# EasyEDA Pro project 基于LVGL与Free RTOS的智能终端.eprj

# Schematic Schematic1
Board Name: Board1; Create Date: 2025-12-01; Page Name: P1; Project Name: 基于LVGL与Free RTOS的智能终端; Schematic Name: Schematic1; Update Date: 2025-12-01; Company: 嘉立创EDA; Page Size: A4; Version: V1.0
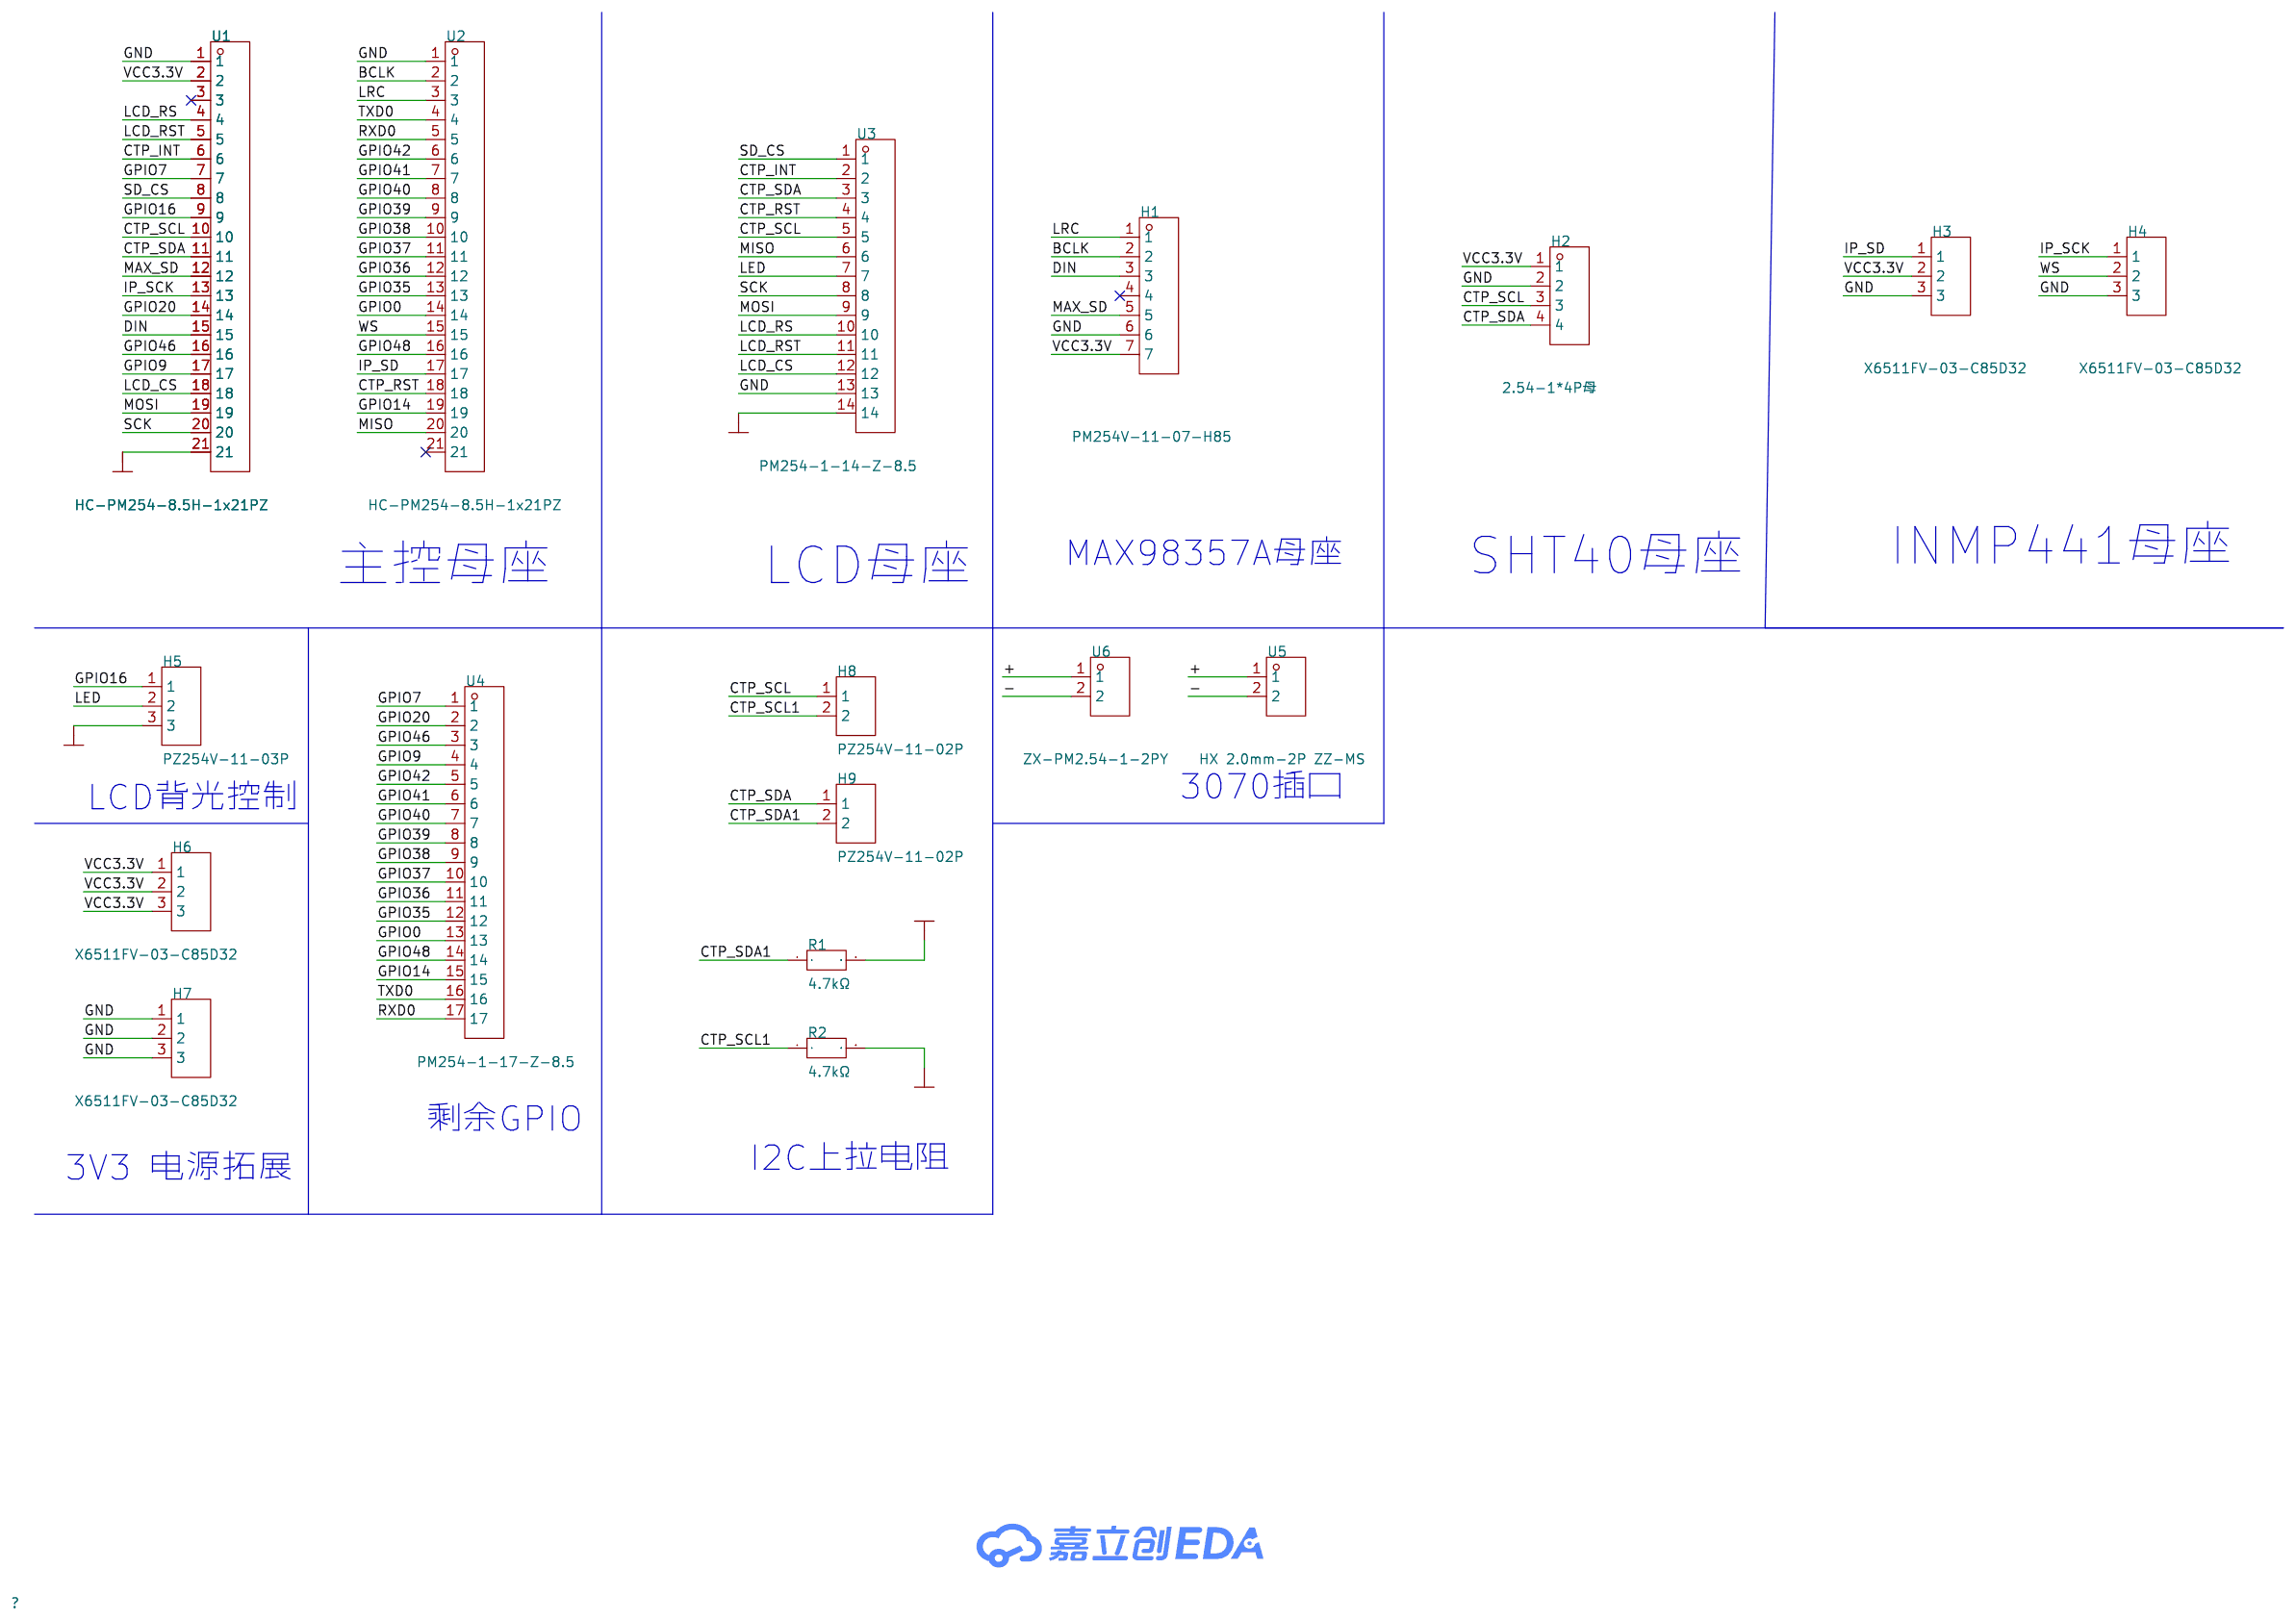
[diagram p0: schematic sheet]

## Parts
H1  PM254V-11-07-H85  [HDR-TH_7P-P2.54-V-F]
H2  2.54-1*4P母  [HDR-TH_4P-P2.54-V-F]
H3  X6511FV-03-C85D32  [HDR-TH_3P-P2.54-V-F]
H4  X6511FV-03-C85D32  [HDR-TH_3P-P2.54-V-F]
H5  PZ254V-11-03P  [HDR-TH_3P-P2.54-V-M]
H6  X6511FV-03-C85D32  [HDR-TH_3P-P2.54-V-F]
H7  X6511FV-03-C85D32  [HDR-TH_3P-P2.54-V-F]
H8  PZ254V-11-02P  [HDR-TH_2P-P2.54-V-M]
H9  PZ254V-11-02P  [HDR-TH_2P-P2.54-V-M]
R1  4.7kΩ  [R0603]
R2  4.7kΩ  [R0603]
U1  HC-PM254-8.5H-1x21PZ  [HDR-TH_21P-P2.54-V-F_1]
U2  HC-PM254-8.5H-1x21PZ  [HDR-TH_21P-P2.54-V-F_1]
U3  PM254-1-14-Z-8.5  [HDR-TH_14P-P2.54-V-F-1]
U4  PM254-1-17-Z-8.5  [HDR-TH_17P-P2.54-V-F]
U5  HX 2.0mm-2P ZZ-MS  [CONN-TH_2P-P2.00_HX-2.0MM-2P-ZZ]
U6  ZX-PM2.54-1-2PY  [HDR-TH_2P-P2.54-V-F]

## Library data of the parts
H1 = PM254V-11-07-H85: LCSC Part Name: 间距:2.54mm 1x7P 直插; Supplier Part: C2832270; Manufacturer: XFCN(兴飞); Supplier Footprint: 插件,P=2.54mm; JLCPCB Part Class: 扩展库; Datasheet: https://item.szlcsc.com/datasheet/PM254V-11-07-H85/2989788.html; Supplier: LCSC; Holes Structure: 1x7P; Pitch: 2.54mm; Circular Hole / Square Hole: 方孔; Mounting Type: 直插; Number of Rows: 单排; Number of Positions: 7P; Current Rating: 3A; Voltage Rating (Max): 250V; Holes Direction: 顶部; Operating Temperature: -40℃~+105℃
H2 = 2.54-1*4P母: LCSC Part Name: 间距:2.54mm 1x4P 直插; Supplier Part: C2718488; Manufacturer: BOOMELE(博穆精密); Supplier Footprint: 插件,P=2.54mm; JLCPCB Part Class: 扩展库; Datasheet: https://item.szlcsc.com/datasheet/2.54-1*4P%25E6%25AF%258D/2834502.html; Supplier: LCSC; Holes Structure: 1x4P; Pitch: 2.54mm; Circular Hole / Square Hole: 方孔; Mounting Type: 直插; Number of Rows: 单排; Number of Positions: 4P; Current Rating: 3A; Holes Direction: 顶部; Contact Material: 青铜; Operating Temperature: -40℃~+105℃
H3 H4 H6 H7 = X6511FV-03-C85D32: LCSC Part Name: 间距:2.54mm 1x3P 直插; Supplier Part: C718242; Manufacturer: XKB Connection(中国星坤); Supplier Footprint: 插件,P=2.54mm; JLCPCB Part Class: 扩展库; Datasheet: https://item.szlcsc.com/datasheet/X6511FV-03-C85D32/760117.html; Supplier: LCSC; Holes Structure: 1x3P; Pitch: 2.54mm; Circular Hole / Square Hole: 方孔; Mounting Type: 直插; Number of Rows: 单排; Number of Positions: 3P; Current Rating: 3A; Voltage Rating (Max): 250V; Holes Direction: 顶部; Insulation Height: 8.5mm; Contact Material: 黄铜; Contact Plating: 金; Operating Temperature: -40℃~+105℃
H5 = PZ254V-11-03P: LCSC Part Name: 1x3P 间距:2.54mm 方针 直插; Supplier Part: C2937625; Manufacturer: XFCN(兴飞); Supplier Footprint: 插件,P=2.54mm; JLCPCB Part Class: 扩展库; Datasheet: https://item.szlcsc.com/datasheet/PZ254V-11-03P/3293280.html; Supplier: LCSC; Pin Structure: 1x3P; Pitch: 2.54mm; Circluar Pins/Square Pins: 方针; Mounting Type: 直插; Number of Rows: 单排; Number of Pins: 3P; Current Rating: 3A; Voltage Rating (Max): 250V; Length of Mating Pin: 6mm; Insulation Height: 2.5mm; Length of End Connection Pin: 3mm; Operating Temperature: -40℃~+105℃; Color: 黑色
H8 H9 = PZ254V-11-02P: LCSC Part Name: 1x2P 间距:2.54mm 方针 直插; Supplier Part: C492401; Manufacturer: XFCN(兴飞); Supplier Footprint: 插件,P=2.54mm; JLCPCB Part Class: 扩展库; Datasheet: https://item.szlcsc.com/datasheet/PZ254V-11-02P/502957.html; Supplier: LCSC; Pin Structure: 1x2P; Pitch: 2.54mm; Circluar Pins/Square Pins: 方针; Mounting Type: 直插; Number of Rows: 单排; Number of Pins: 2P; Length of Mating Pin: 6mm; Insulation Height: 2.5mm; Length of End Connection Pin: 3mm; Contact Material: 黄铜; Operating Temperature: -40℃~+105℃; Color: 黑色
R1 R2 = RCA034K7JLF: LCSC Part Name: 4.7kΩ ±5% 100mW; Supplier Part: C22356632; Manufacturer: HKR(香港电阻); Supplier Footprint: 0603; JLCPCB Part Class: 扩展库; Datasheet: https://item.szlcsc.com/datasheet/RCA034K7JLF/23790076.html; Supplier: LCSC; Type: 厚膜电阻; Tolerance: ±5%; Power(Watts): 100mW; Voltage-Supply(Max): 75V; Temperature Coefficient: ±100ppm/℃; Operating Temperature: -55℃~+155℃
U1 U2 = HC-PM254-8.5H-1x21PZ: LCSC Part Name: 间距2.54mm 1x21Pin 直插 PC3.0 H8.5; Supplier Part: C41376160; Manufacturer: HC(虹成电子); Supplier Footprint: 插件,P=2.54mm; JLCPCB Part Class: 扩展库; Datasheet: https://item.szlcsc.com/datasheet/HC-PM254-8.5H-1x21PZ/43143859.html; Supplier: LCSC; Holes Structure: 1x21P; Pitch: 2.54mm; Circular Hole / Square Hole: 方孔; Mounting Type: 直插; Number of Rows: 单排; Number of Positions: 21P; Current Rating: 3A; Holes Direction: 顶部; Insulation Height: 8.5mm; Contact Material: 黄铜; Contact Plating: 金; Operating Temperature: -40℃~+105℃; PIN Length: 3mm
U3 = PM254-1-14-Z-8.5: LCSC Part Name: 1x14P 间距:2.54mm 直插; Supplier Part: C2897377; Manufacturer: HCTL(华灿天禄); Supplier Footprint: 插件,P=2.54mm; JLCPCB Part Class: 扩展库; Datasheet: https://item.szlcsc.com/datasheet/PM254-1-14-Z-8.5/3142382.html; Supplier: LCSC; Holes Structure: 1x14P; Pitch: 2.54mm; Circular Hole / Square Hole: 方孔; Mounting Type: 直插; Number of Rows: 单排; Number of Positions: 14P; Current Rating: 3A; Holes Direction: 顶部; Insulation Height: 8.5mm; Contact Material: 铜合金; Operating Temperature: -40℃~+105℃
U4 = PM254-1-17-Z-8.5: LCSC Part Name: 1x17P 间距:2.54mm 直插; Supplier Part: C2897380; Manufacturer: HCTL(华灿天禄); Supplier Footprint: 插件,P=2.54mm; JLCPCB Part Class: 扩展库; Datasheet: https://item.szlcsc.com/datasheet/PM254-1-17-Z-8.5/3142385.html; Supplier: LCSC; Holes Structure: 1x17P; Pitch: 2.54mm; Circular Hole / Square Hole: 方孔; Mounting Type: 直插; Number of Rows: 单排; Number of Positions: 17P; Current Rating: 3A; Holes Direction: 顶部; Insulation Height: 8.5mm; Contact Material: 铜合金; Operating Temperature: -40℃~+105℃
U5 = HX 2.0mm-2P ZZ-MS: LCSC Part Name: 1x2P 间距:2mm 直插 系列:PH; Supplier Part: C7543406; Manufacturer: hanxia(韩下); Supplier Footprint: 插件,P=2mm; Datasheet: https://item.szlcsc.com/datasheet/HX%25202.0mm-2P%2520ZZ-MS/8648012.html; Supplier: LCSC; Pins Structure: 1x2P; Pitch: 2mm; Mounting Type: 直插; Reference Series: PH; Number of Pins: 2P; Number of Rows: 1; Number of PINs Per Row: 2; Current Rating: 2A; Contact Material: 黄铜; Contact Plating: 锡; Operating Temperature: -25℃~+85℃; Voltage Rating: 250V; Plastic Material: PA6T; Flame Retardant Rating: UL94V-0; Color: 米色
U6 = ZX-PM2.54-1-2PY: LCSC Part Name: 1x2P 间距:2.54mm 直插; Supplier Part: C7499322; Manufacturer: Megastar(兆星); Supplier Footprint: 插件,P=2.54mm; Datasheet: https://item.szlcsc.com/datasheet/ZX-PM2.54-1-2PY/8573983.html; Supplier: LCSC; Holes Structure: 1x2P; Pitch: 2.54mm; Circular Hole / Square Hole: 方孔; Mounting Type: 直插; Number of Rows: 单排; Number of Positions: 2P; Current Rating: 3A; Holes Direction: 顶部; Insulation Height: 8.5mm; Contact Material: 黄铜; Contact Plating: 金; Operating Temperature: -40℃~+105℃; PIN Length: 3.2mm

## Nets
3V3: H5.3 R1.2 R2.2 U1.21 U3.14
GND: H1.6 H2.2 H3.3 H4.3 H7.1 H7.2 H7.3 U1.1 U2.1 U3.13
VCC3.3V: H1.7 H2.1 H3.2 H6.1 H6.2 H6.3 U1.2
+: U5.1 U6.1
-: U5.2 U6.2
BCLK: H1.2 U2.2
CTP_INT: U1.6 U3.2
CTP_RST: U2.18 U3.4
CTP_SCL: H2.3 H8.1 U1.10 U3.5
CTP_SCL1: H8.2 R2.1
CTP_SDA: H2.4 H9.1 U1.11 U3.3
CTP_SDA1: H9.2 R1.1
DIN: H1.3 U1.15
GPIO0: U2.14 U4.13
GPIO7: U1.7 U4.1
GPIO9: U1.17 U4.4
GPIO14: U2.19 U4.15
GPIO16: H5.1 U1.9
GPIO20: U1.14 U4.2
GPIO35: U2.13 U4.12
GPIO36: U2.12 U4.11
GPIO37: U2.11 U4.10
GPIO38: U2.10 U4.9
GPIO39: U2.9 U4.8
GPIO40: U2.8 U4.7
GPIO41: U2.7 U4.6
GPIO42: U2.6 U4.5
GPIO46: U1.16 U4.3
GPIO48: U2.16 U4.14
IP_SCK: H4.1 U1.13
IP_SD: H3.1 U2.17
LCD_CS: U1.18 U3.12
LCD_RS: U1.4 U3.10
LCD_RST: U1.5 U3.11
LED: H5.2 U3.7
LRC: H1.1 U2.3
MAX_SD: H1.5 U1.12
MISO: U2.20 U3.6
MOSI: U1.19 U3.9
RXD0: U2.5 U4.17
SCK: U1.20 U3.8
SD_CS: U1.8 U3.1
TXD0: U2.4 U4.16
WS: H4.2 U2.15

Not connected (* = marked no-connect by the designer): H1 4*; U1 3*; U2 21*

## Notes on the sheet
- MAX98357A母座
- INMP441母座
- 主控母座
- LCD母座
- SHT40母座
- 3070插口
- LCD背光控制
- 剩余GPIO
- I2C上拉电阻
- 3V3 电源拓展

# Board PCB1
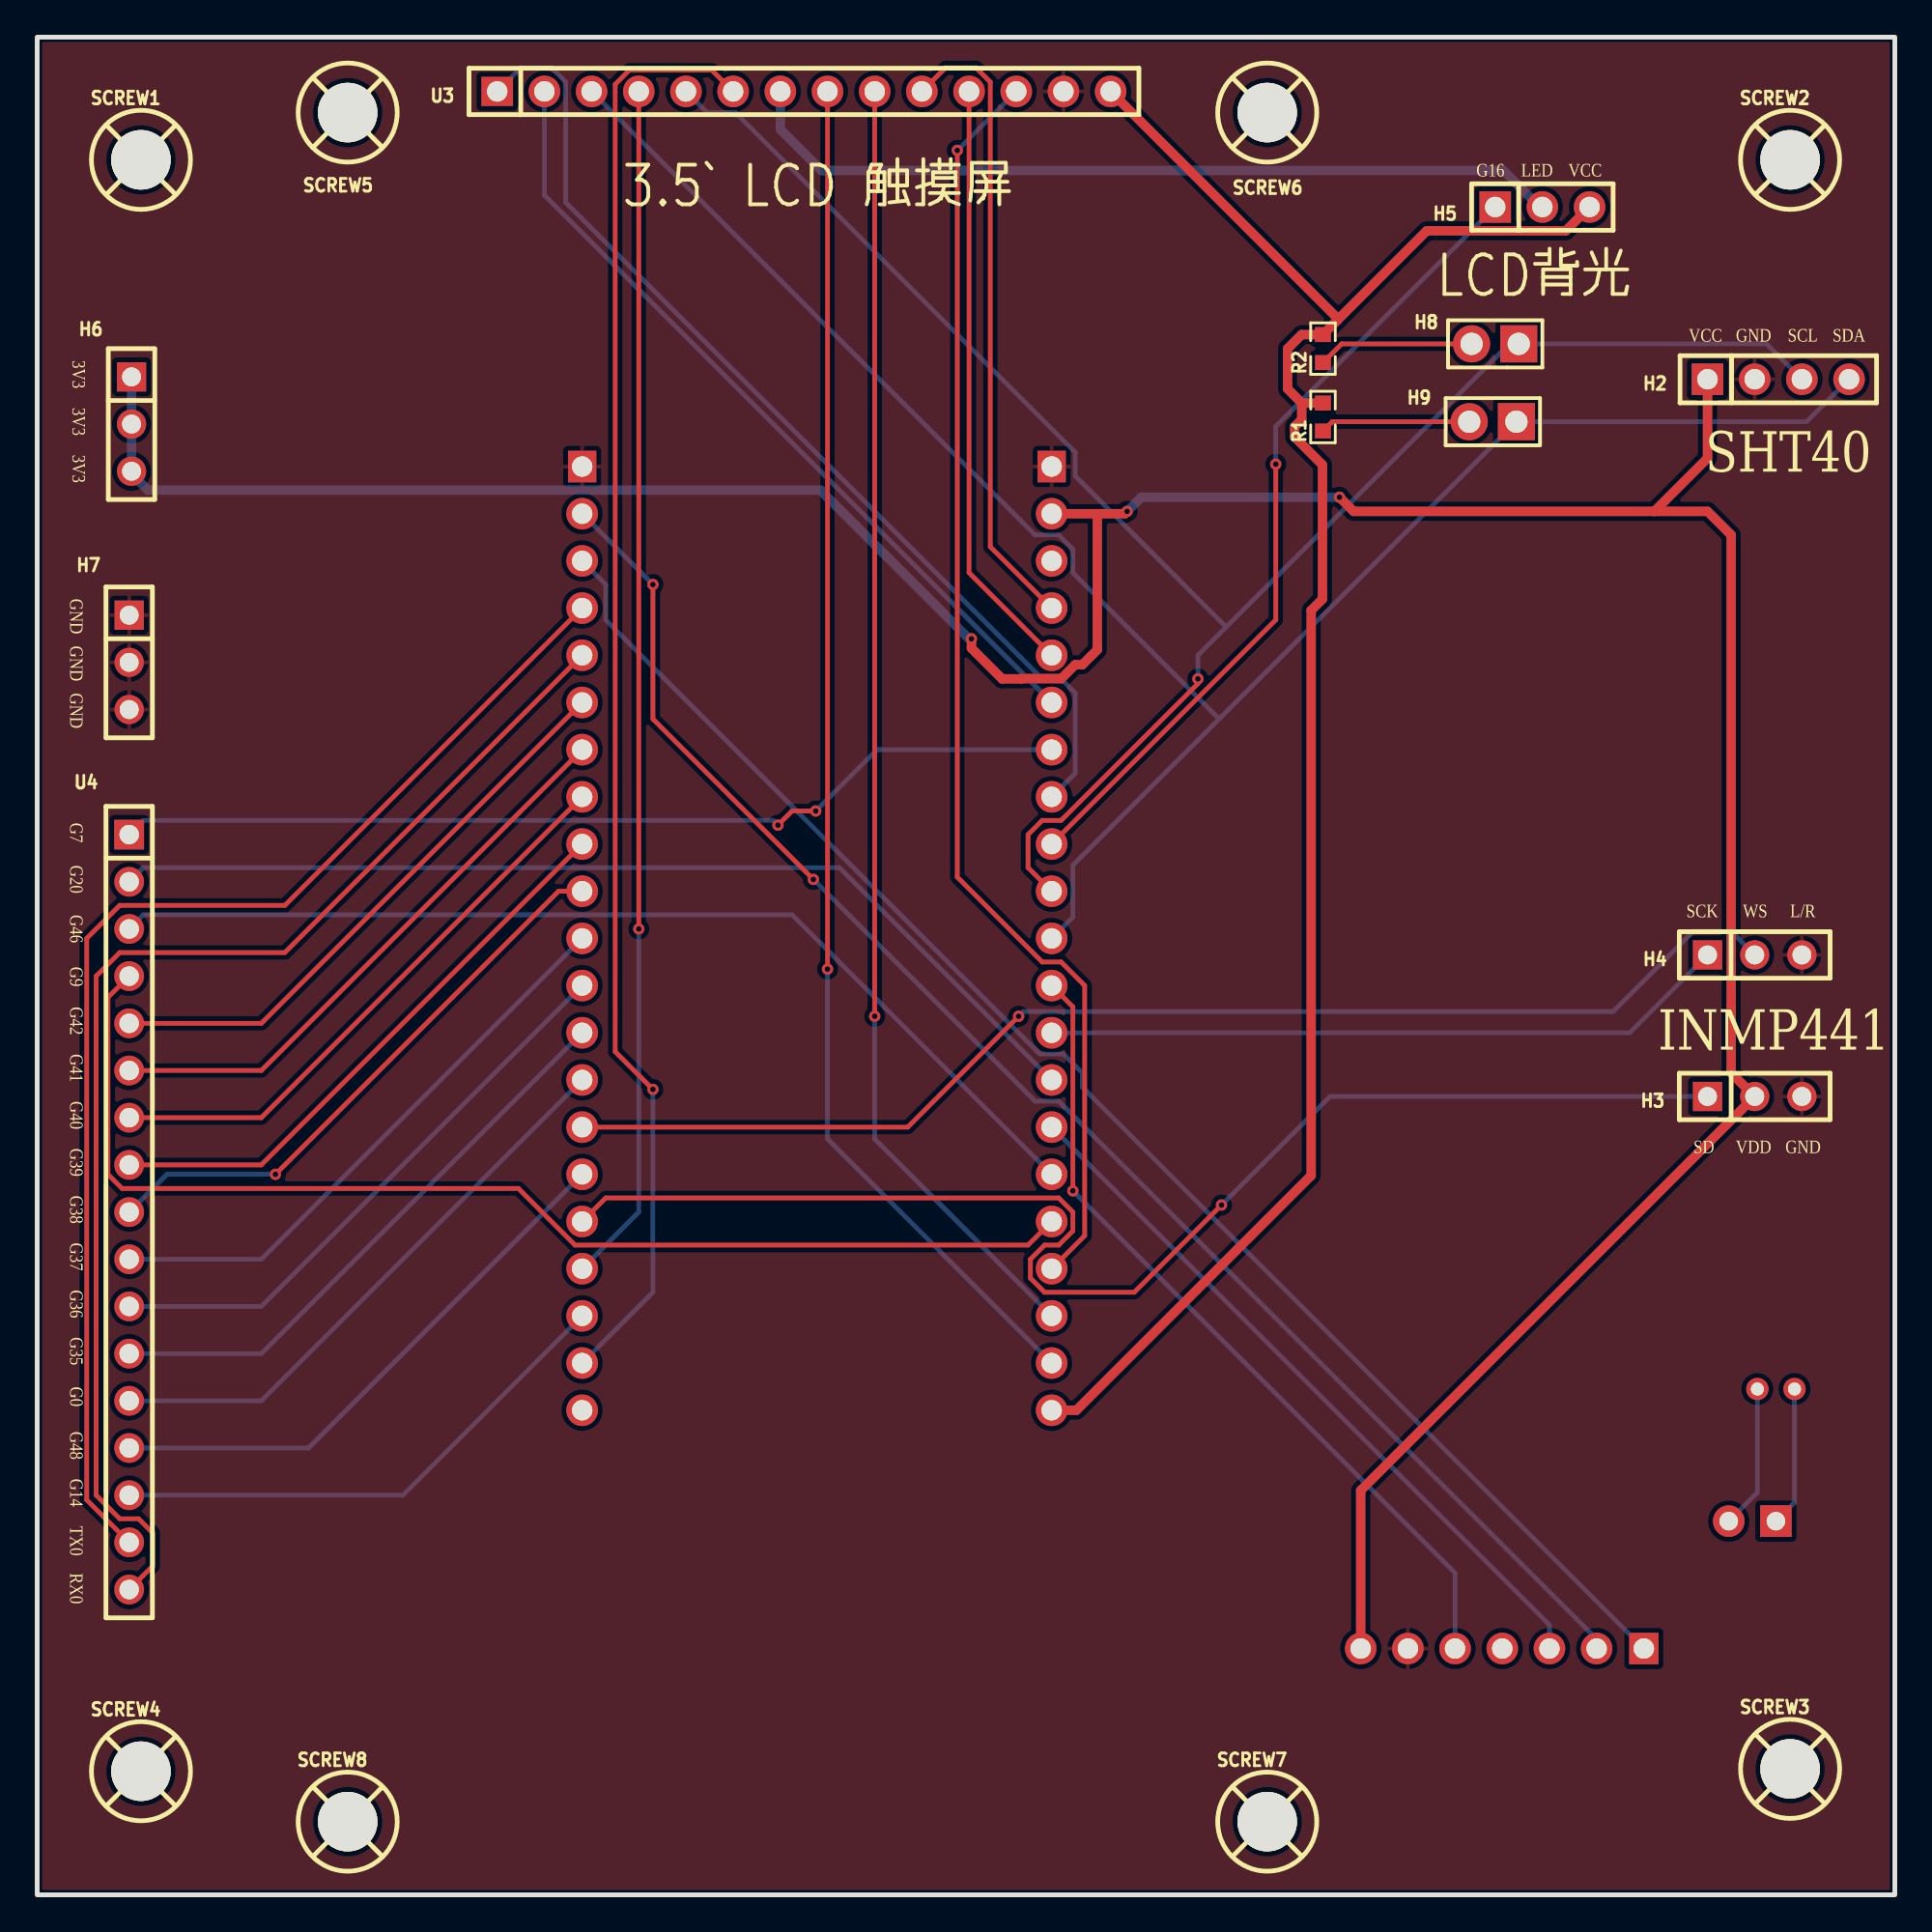
[diagram p1: board, top side]
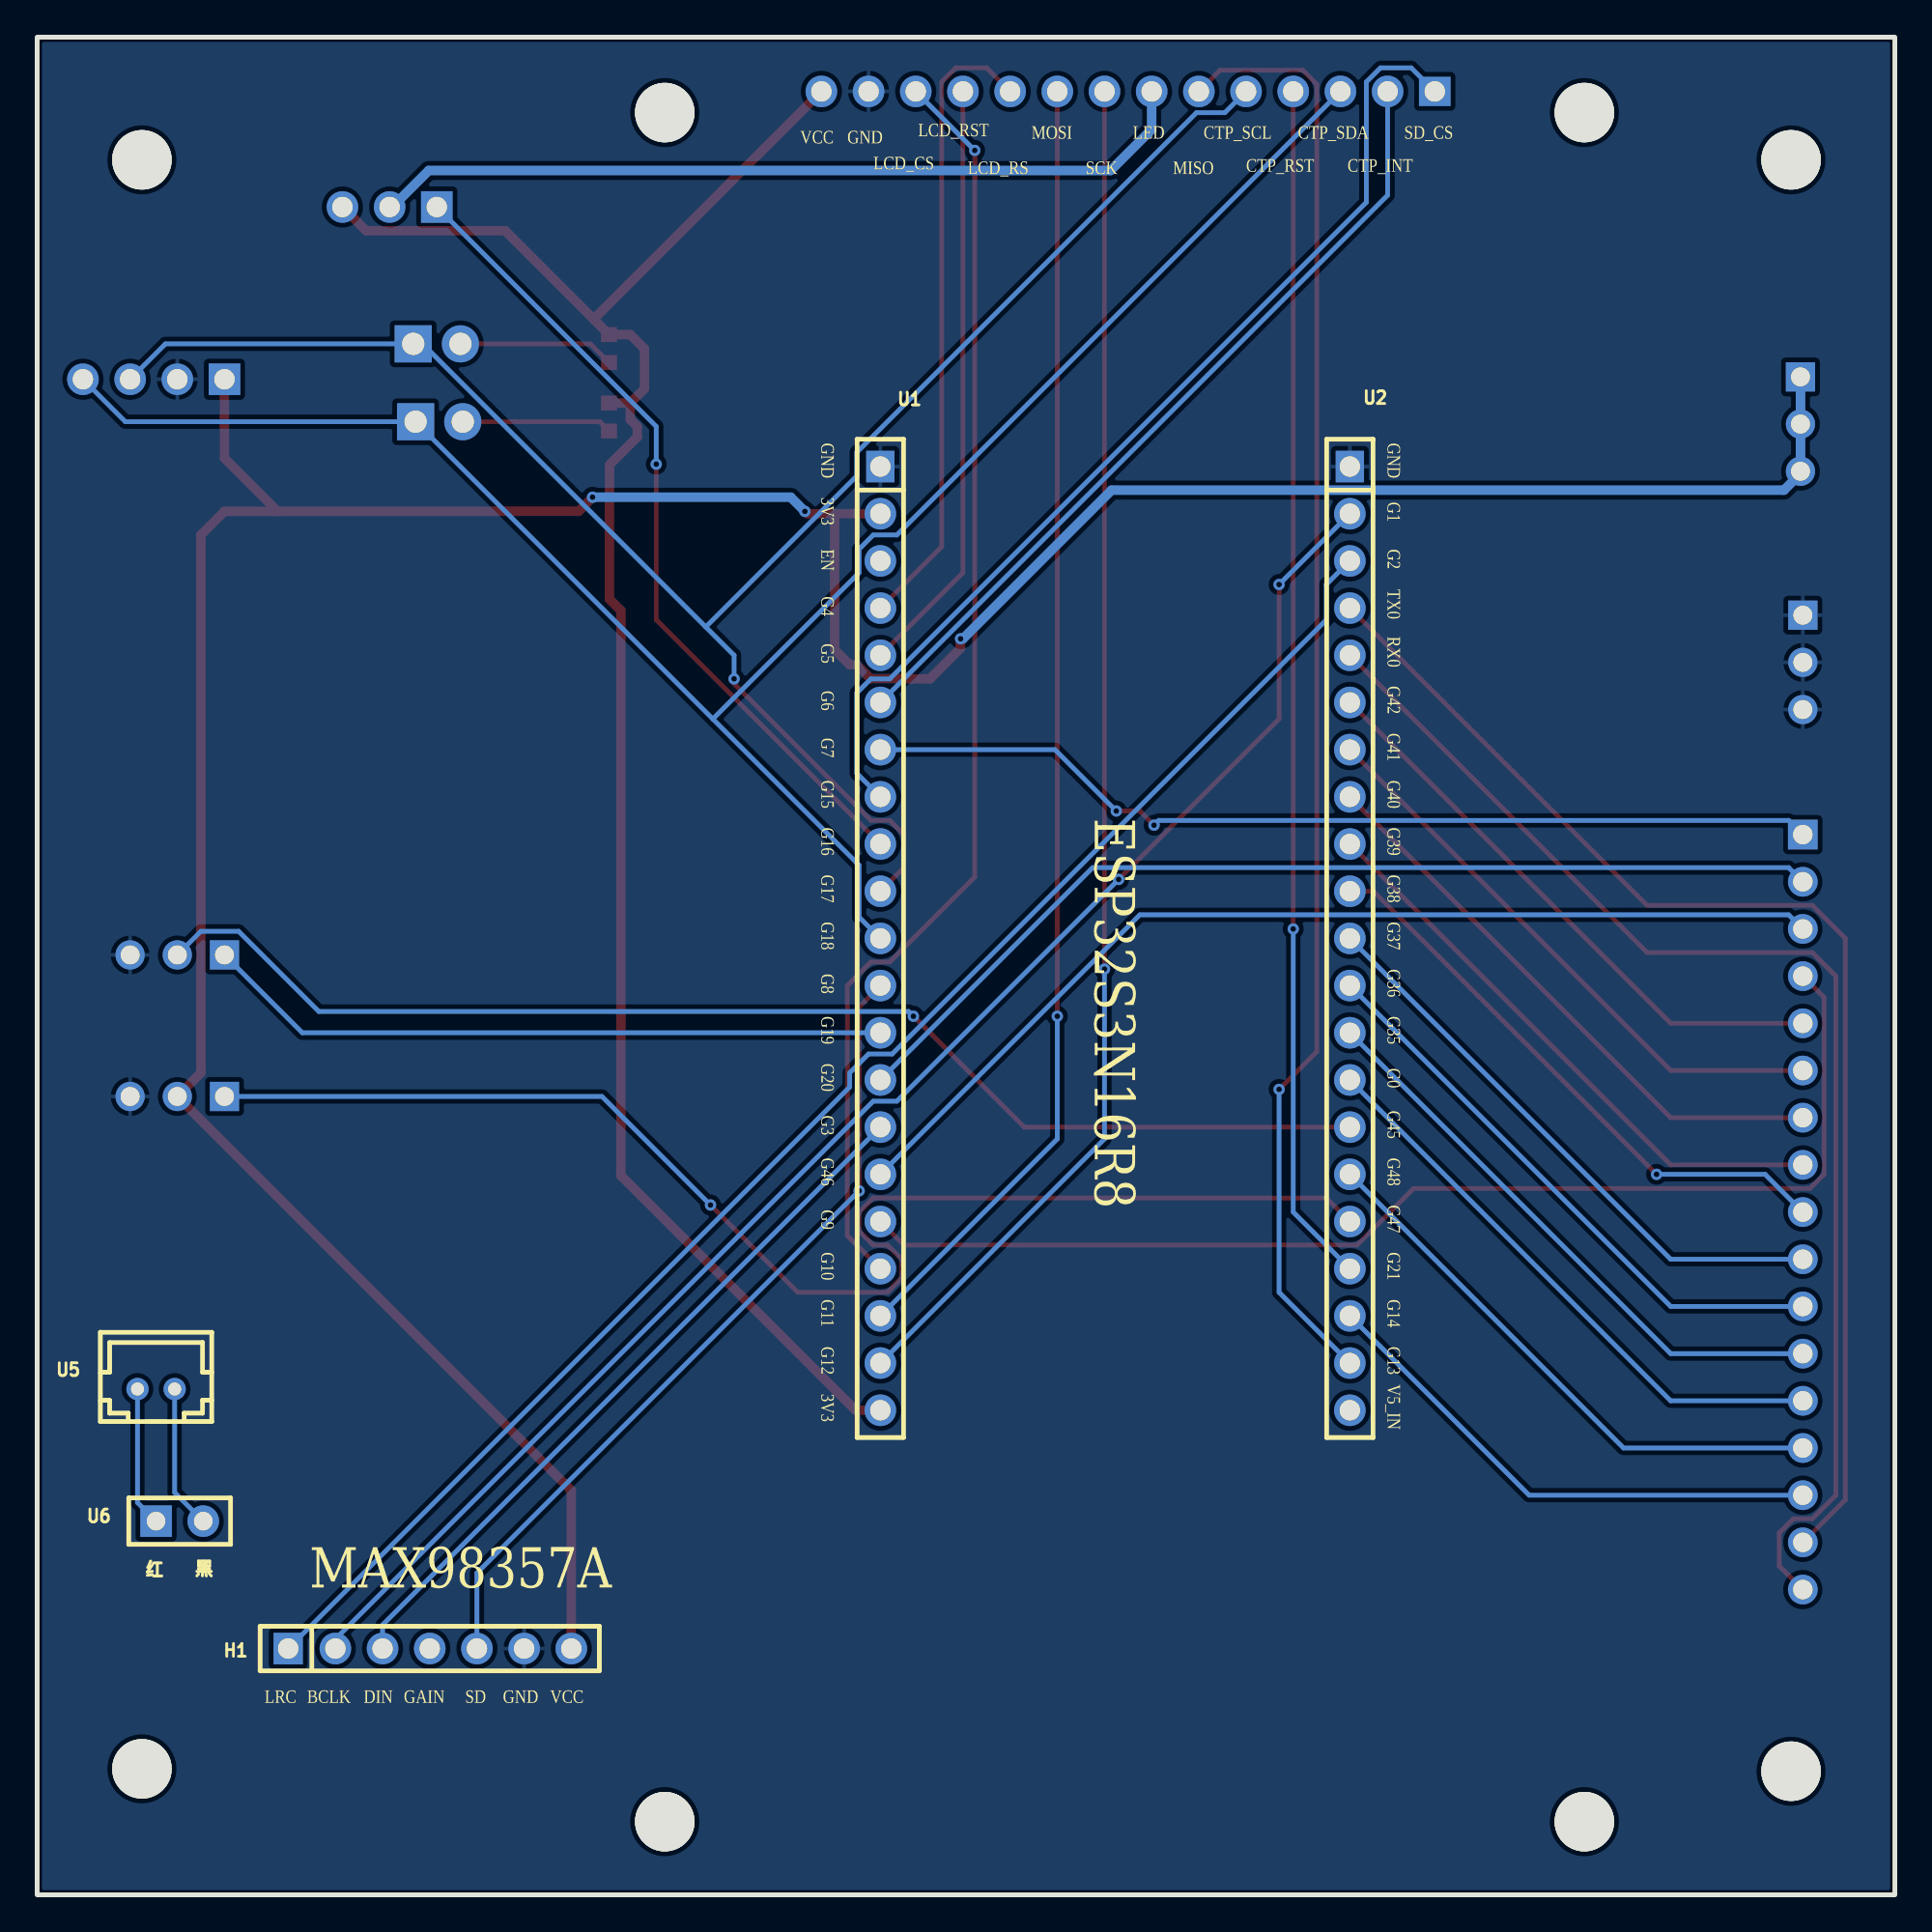
[diagram p2: board, bottom side, seen from below]

Outline 100 x 100 mm; copper layers: Top Layer, Bottom Layer. Coordinates in mm from the lower left corner of the outline.
Outline path: rectangle 0,100 100,0
Stack: Top Layer 0.035mm / Dielectric1 1.51mm FR4 er 4.5 / Bottom Layer 0.035mm

## Design rules (mm)
template: JLCPCB Capability(Two Layers Board)
spacing copperThickness1oz (default): track to track 0.102, other pairs 0.152 to 0.3
spacing copperThickness2oz: track to track 0.203, other pairs 0.152 to 0.3
track width copperThickness1oz (default): min 0.127, default 0.254, max 2.54
track width copperThickness2oz: min 0.203, default 0.254, max 2.54
differential pair differentialPair (default): width min 0.127, default 0.254, max 2.54; gap min 0.152, default 0.152
via viaSize (default): diameter min 0.5, default 0.61, max 10; hole min 0.3, default 0.305, max 6.3

## Placement (name value [footprint] x y rotation side)
H1  PM254V-11-07-H85  [HDR-TH_7P-P2.54-V-F]  78.87 13.26 180 bottom
H2  2.54-1*4P母  [HDR-TH_4P-P2.54-V-F]  93.73 81.58 0 top
H3  X6511FV-03-C85D32  [HDR-TH_3P-P2.54-V-F]  92.46 42.98 0 top
H4  X6511FV-03-C85D32  [HDR-TH_3P-P2.54-V-F]  92.46 50.6 0 top
H5  PZ254V-11-03P  [HDR-TH_3P-P2.54-V-M]  81.03 90.86 0 top
H6  X6511FV-03-C85D32  [HDR-TH_3P-P2.54-V-F]  5.08 79.17 270 top
H7  X6511FV-03-C85D32  [HDR-TH_3P-P2.54-V-F]  4.95 66.34 270 top
H8  PZ254V-11-02P  [HDR-TH_2P-P2.54-V-M]  78.49 83.49 180 top
H9  PZ254V-11-02P  [HDR-TH_2P-P2.54-V-M]  78.36 79.3 180 top
R1  4.7kΩ  [R0603]  69.22 79.55 90 top
R2  4.7kΩ  [R0603]  69.22 83.24 90 top
SCREW1  -  [M3螺丝]  5.59 93.4 0 top
SCREW2  -  [M3螺丝]  94.36 93.4 0 top
SCREW3  -  [M3螺丝]  94.36 6.78 0 top
SCREW4  -  [M3螺丝]  5.59 6.66 0 top
SCREW5  -  [M3螺丝]  16.72 95.94 0 top
SCREW6  -  [M3螺丝]  66.22 95.94 0 top
SCREW7  -  [M3螺丝]  66.22 3.94 0 top
SCREW8  -  [M3螺丝]  16.72 3.94 0 top
U1  HC-PM254-8.5H-1x21PZ  [HDR-TH_21P-P2.54-V-F_1]  54.61 51.49 270 bottom
U2  HC-PM254-8.5H-1x21PZ  [HDR-TH_21P-P2.54-V-F_1]  29.34 51.49 270 bottom
U3  PM254-1-14-Z-8.5  [HDR-TH_14P-P2.54-V-F-1]  41.28 97.08 0 top
U4  PM254-1-17-Z-8.5  [HDR-TH_17P-P2.54-V-F]  4.95 36.75 270 top
U5  HX 2.0mm-2P ZZ-MS  [CONN-TH_2P-P2.00_HX-2.0MM-2P-ZZ]  93.6 27.23 180 bottom
U6  ZX-PM2.54-1-2PY  [HDR-TH_2P-P2.54-V-F]  92.33 20.12 180 bottom

## Footprints (pads in the part's own frame, mm; a bottom-side part is the same pattern mirrored in y, then rotated)
CONN-TH_2P-P2.00_HX-2.0MM-2P-ZZ
  round 1.2 hole 0.7: 1(-1,0) 2(1,0)
HDR-TH_2P-P2.54-V-F
  rect 1.7x1.7 hole 1: 1(-1.27,0)
  round 1.7 hole 1: 2(1.27,0)
HDR-TH_2P-P2.54-V-M
  rect 2x2 hole 1.2: 1(-1.27,0)
  round 2 hole 1.2: 2(1.27,0)
HDR-TH_3P-P2.54-V-F
  rect 1.575x1.575 hole 1.02: 1(-2.54,0)
  round 1.575 hole 1.02: 2(0,0) 3(2.54,0)
HDR-TH_3P-P2.54-V-M
  rect 1.7x1.7 hole 1.1: 1(-2.54,0)
  round 1.7 hole 1.1: 2(0,0) 3(2.54,0)
HDR-TH_4P-P2.54-V-F
  rect 1.7x1.7 hole 1.1: 1(-3.81,0)
  round 1.7 hole 1.1: 2(-1.27,0) 3(1.27,0) 4(3.81,0)
HDR-TH_7P-P2.54-V-F
  rect 1.575x1.7 hole 1.1: 1(-7.62,0)
  round 1.7 hole 1.1: 2(-5.08,0) 3(-2.54,0) 4(0,0) 5(2.54,0) 6(5.08,0) 7(7.62,0)
HDR-TH_14P-P2.54-V-F-1
  rect 1.7x1.575 hole 1.1: 1(-16.51,0)
  round 1.7 hole 1.1: 2(-13.97,0) 3(-11.43,0) 4(-8.89,0) 5(-6.35,0) 6(-3.81,0) 7(-1.27,0) 8(1.27,0) 9(3.81,0) 10(6.35,0) 11(8.89,0) 12(11.43,0) 13(13.97,0) 14(16.51,0)
HDR-TH_17P-P2.54-V-F
  rect 1.6x1.6 hole 1.05: 1(-20.32,0)
  round 1.6 hole 1.05: 2(-17.78,0) 3(-15.24,0) 4(-12.7,0) 5(-10.16,0) 6(-7.62,0) 7(-5.08,0) 8(-2.54,0) 9(0,0) 10(2.54,0) 11(5.08,0) 12(7.62,0) 13(10.16,0) 14(12.7,0) 15(15.24,0) 16(17.78,0) 17(20.32,0)
HDR-TH_21P-P2.54-V-F_1
  rect 1.7x1.524 hole 1.1: 1(-25.4,0)
  round 1.7 hole 1.1: 2(-22.86,0) 3(-20.32,0) 4(-17.78,0) 5(-15.24,0) 6(-12.7,0) 7(-10.16,0) 8(-7.62,0) 9(-5.08,0) 10(-2.54,0) 11(0,0) 12(2.54,0) 13(5.08,0) 14(7.62,0) 15(10.16,0) 16(12.7,0) 17(15.24,0) 18(17.78,0) 19(20.32,0) 20(22.86,0) 21(25.4,0)
M3螺丝
  round 3.2 hole 3.2: 1(0,0)
R0603
  rect 0.806x0.864 smd: 1(-0.753,0) 2(0.753,0)

## Nets
As in the schematic.

Pads without a net: H1 4; SCREW1 1; SCREW2 1; SCREW3 1; SCREW4 1; SCREW5 1; SCREW6 1; SCREW7 1; SCREW8 1; U1 3; U2 21

## Via types
v1: diameter 0.61, hole 0.305, Top Layer to Bottom Layer, 18 vias

## Routing (per net, layer and track width the routed paths; a pad name or vN(x,y) marks a point on that pad's centre or on a via; arc(x,y) is an arc through that point)
3V3: length 103
  Top Layer w0.508: 69.98,84.75 R2.2 68.07,83.99 67.31,83.23 67.31,81.07 68.07,80.31 ; 69.98,84.75 74.8,89.58 82.29,89.58 H5.3 ; 69.98,84.75 69.98,84.89 U3.14 ; 68.07,80.31 68.07,79.42 67.69,79.04 67.69,78.47 69.19,76.97 69.19,69.75 68.58,69.14 68.58,38.72 55.94,26.09 U1.21 ; 68.07,80.31 R1.2
VCC3.3V: length 185.4
  Top Layer w0.508: H1.7 71.25,21.77 H3.2 91.19,44.25 91.19,73.2 89.92,74.47 87.05,74.47 ; v1(58.67,74.47) 58.55,74.35 57.07,74.35 ; 57.07,74.35 57.07,67.03 56.26,66.22 55.88,66.22 55.13,65.47 52.97,65.47 52.96,65.46 51.94,65.46 50.29,67.11 v1(50.29,67.61) ; 57.07,74.35 U1.2 ; 87.05,74.47 70.87,74.47 v1(70.1,75.23) ; 87.05,74.47 89.92,77.34 H2.1
  Bottom Layer w0.508: H6.1 H6.2 H6.3 5.08,76.5 5.97,75.62 42.16,75.62 50.16,67.61 v1(50.29,67.61) ; v1(70.1,75.23) 59.44,75.23 v1(58.67,74.47)
+: length 7.5
  Bottom Layer w0.254: U5.1 94.6,21.12 U6.1
-: length 7.7
  Bottom Layer w0.254: U6.2 92.6,21.66 U5.2
BCLK: length 84.5
  Top Layer w0.254: v1(33.15,70.54) 33.15,63.3 v1(41.78,54.66)
  Bottom Layer w0.254: v1(33.15,70.54) U2.2 ; v1(41.78,54.66) 53.72,42.72 54.99,42.72 83.95,13.77 H1.2
CTP_INT: length 44.2
  Bottom Layer w0.254: U1.6 27.31,91.49 U3.2
CTP_RST: length 64.6
  Top Layer w0.254: v1(32.38,51.99) U3.4
  Bottom Layer w0.254: v1(32.38,51.99) 32.38,36.75 U2.18
CTP_SCL: length 99.6
  Top Layer w0.254: v1(62.48,65.46) 62.48,65.2 55.12,57.84 54.1,57.84 53.34,57.07 53.34,55.3 U1.10
  Bottom Layer w0.254: 64.01,68.25 79.25,83.49 H8.1 93.09,83.49 H2.3 ; 64.01,68.25 55.88,76.38 55.88,77.65 37.59,95.94 36.07,95.94 U3.5 ; 64.01,68.25 62.48,66.73 v1(62.48,65.46)
CTP_SCL1: length 8.4
  Top Layer w0.254: H8.2 70.22,83.49 R2.1
CTP_SDA: length 105.5
  Bottom Layer w0.254: H2.4 95.25,79.3 79.63,79.3 63.63,63.3 ; U1.11 55.75,52.63 55.75,55.42 63.63,63.3 ; 63.63,63.3 55.75,71.17 55.75,72.44 54.99,73.2 53.72,73.2 U3.3
CTP_SDA1: length 8.1
  Top Layer w0.254: H9.2 69.71,79.3 R1.1
DIN: length 39.2
  Bottom Layer w0.254: U1.15 81.41,14.53 81.41,13.26
GPIO0: length 31.5
  Bottom Layer w0.254: U4.13 12.06,26.59 U2.14
GPIO7: length 51.8
  Top Layer w0.254: v1(41.91,58.34) 40.64,58.34 v1(39.88,57.58)
  Bottom Layer w0.254: v1(39.88,57.58) 39.62,57.84 5.72,57.84 U4.1 ; U1.7 45.21,61.65 v1(41.91,58.34)
GPIO9: length 64
  Top Layer w0.254: U1.17 53.34,34.98 28.96,34.98 25.91,38.02 4.57,38.02 3.81,38.79 3.81,48.31 U4.4
GPIO14: length 28.4
  Bottom Layer w0.254: U4.15 19.69,21.51 U2.19
GPIO16: length 44.2
  Top Layer w0.254: v1(66.68,77.01) 66.68,68.63 U1.9
  Bottom Layer w0.254: v1(66.68,77.01) 66.68,79.05 H5.1
GPIO20: length 54.7
  Bottom Layer w0.254: U4.2 5.72,55.3 43.18,55.3 U1.14
GPIO35: length 31.5
  Bottom Layer w0.254: U2.13 12.06,29.13 U4.12
GPIO36: length 31.5
  Bottom Layer w0.254: U2.12 12.06,31.67 U4.11
GPIO37: length 31.5
  Bottom Layer w0.254: U2.11 12.06,34.21 U4.10
GPIO38: length 31.5
  Top Layer w0.254: U2.10 28.07,54.03 v1(12.83,38.79)
  Bottom Layer w0.254: U4.9 6.98,38.79 v1(12.83,38.79)
GPIO39: length 31.5
  Top Layer w0.254: U2.9 12.06,39.29 U4.8
GPIO40: length 31.5
  Top Layer w0.254: U4.7 12.06,41.83 U2.8
GPIO41: length 31.5
  Top Layer w0.254: U4.6 12.06,44.37 U2.7
GPIO42: length 31.5
  Top Layer w0.254: U2.6 12.06,46.91 U4.5
GPIO46: length 55.8
  Bottom Layer w0.254: U4.3 5.72,52.76 40.64,52.76 U1.16
GPIO48: length 30.5
  Bottom Layer w0.254: U2.16 14.61,24.05 U4.14
IP_SCK: length 37
  Bottom Layer w0.254: U1.13 85.72,46.41 H4.1
IP_SD: length 73.3
  Top Layer w0.254: v1(63.75,37.14) 59.06,32.44 54.23,32.44 53.47,33.2 53.47,34.21 54.23,34.98 54.99,34.98 55.75,35.74 55.75,36.75 54.99,37.52 30.61,37.52 U2.17
  Bottom Layer w0.254: v1(63.75,37.14) 69.6,42.98 H3.1
LCD_CS: length 68.9
  Top Layer w0.254: U1.18 56.39,35.48 56.39,48.95 55.12,50.22 54.1,50.22 49.53,54.79 v1(49.53,93.9)
  Bottom Layer w0.254: v1(49.53,93.9) U3.12
LCD_RS: length 34.2
  Top Layer w0.254: U1.4 51.31,72.57 51.31,97.59 50.55,98.35 48.9,98.35 U3.10
LCD_RST: length 32.2
  Top Layer w0.254: 50.16,97.08 50.16,71.17 U1.5
LED: length 44.8
  Bottom Layer w0.508: H5.2 80.9,90.98 80.76,90.98 78.92,92.82 42.22,92.82 40,95.03 U3.7
LRC: length 83
  Bottom Layer w0.254: H1.1 56.26,43.48 56.26,44.25 55.25,45.26 53.97,45.26 30.61,68.63 30.61,70.54 U2.3
MAX_SD: length 44.7
  Top Layer w0.254: v1(55.75,37.9) 55.75,47.8 U1.12
  Bottom Layer w0.254: H1.5 76.33,17.32 v1(55.75,37.9)
MISO: length 78.4
  Top Layer w0.254: U3.6 36.32,98.22 31.88,98.22 31.12,97.46 31.12,45.39 v1(33.15,43.36)
  Bottom Layer w0.254: U2.20 33.15,32.44 v1(33.15,43.36)
MOSI: length 69.9
  Top Layer w0.254: v1(45.09,47.3) U3.9
  Bottom Layer w0.254: v1(45.09,47.3) 45.09,40.69 U1.19
RXD0: length 68.7
  Top Layer w0.254: U4.17 6.22,17.7 6.22,19.48 5.46,20.24 4.44,20.24 3.17,21.51 3.17,49.45 4.44,50.72 13.33,50.72 U2.5
SCK: length 73.5
  Top Layer w0.254: v1(42.54,49.83) 42.54,97.08
  Bottom Layer w0.254: U1.20 42.54,40.69 v1(42.54,49.83)
SD_CS: length 55.5
  Bottom Layer w0.254: U3.1 26.03,98.35 27.69,98.35 28.45,97.59 28.45,91.11 54.1,65.46 55.12,65.46 55.88,64.69 55.88,60.38 U1.8
TXD0: length 67.5
  Top Layer w0.254: U4.16 2.67,21.26 2.67,51.49 4.44,53.26 13.33,53.26 U2.4
WS: length 68
  Top Layer w0.254: U2.15 46.86,41.33 v1(52.83,47.3)
  Bottom Layer w0.254: H4.2 91.19,51.87 89.15,51.87 84.84,47.55 53.09,47.55 v1(52.83,47.3)

## Copper pours and planes (outline as drawn; the poured copper is in the pictures)
GND on Top Layer: 0,100 100,100 100,0 0,0
GND on Bottom Layer: 0,100 100,100 100,0 0,0

## Text on the board
Bottom Silkscreen Layer: GND | G1 | G2 | TX0 | RX0 | G42 | G41 | G40 | G39 | G38 | G37 | G36 | G35 | G0 | G45 | G48 | G47 | G21 | G14 | G13 | V5_IN | 3V3 | EN | G4 | G5 | G6 | G7 | G15 | G16 | G17 | G18 | G8 | G19 | G20 | G3 | G46 | G9 | G10 | G11 | G12 | SD_CS | CTP_INT | CTP_SDA | CTP_RST | CTP_SCL | MISO | LED | SCK | MOSI | LCD_RS | LCD_RST | LCD_CS | VCC | SD | GAIN | DIN | BCLK | LRC | 黑 | 红 | ESP32S3N16R8 | MAX98357A
Top Silkscreen Layer: SCK | VCC | SD | GND | VDD | WS | SCL | L/R | SDA | G7 | G20 | G46 | G9 | G42 | G41 | G40 | G39 | G38 | G37 | G36 | G35 | G0 | G48 | G14 | TX0 | RX0 | 3V3 | G16 | LED | 3.5` LCD 触摸屏 | LCD背光 | INMP441 | SHT40
